# EAGLE design TaschenrechnerPCB (EAGLE 9.6.2)
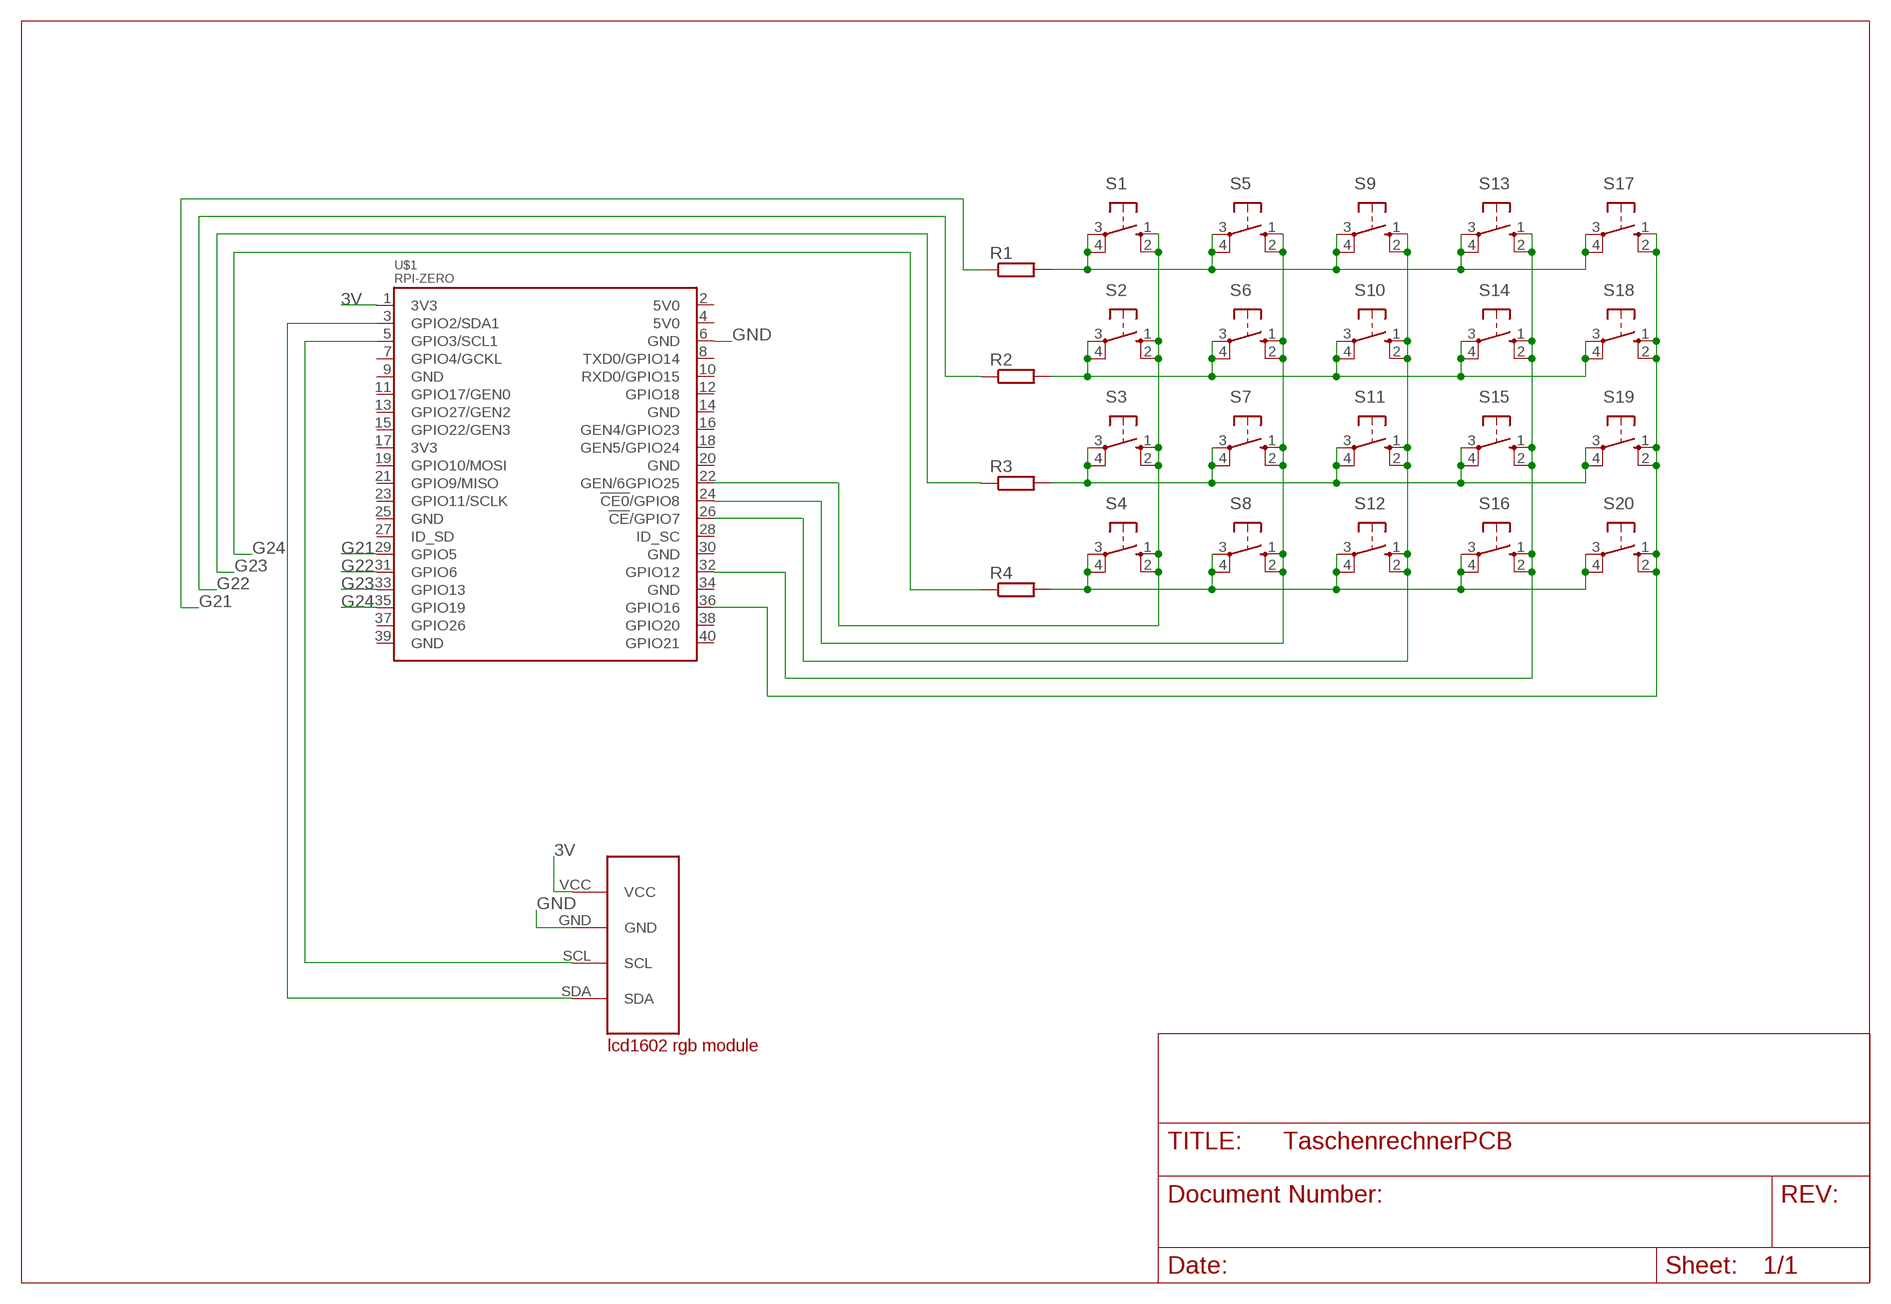
[diagram p0: schematic, sheet 1]

## Parts
R1  R-EU_0207/10  [0207/10]
R2  R-EU_0207/10  [0207/10]
R3  R-EU_0207/10  [0207/10]
R4  R-EU_0207/10  [0207/10]
S1  10-XX  [B3F-10XX]
S2  10-XX  [B3F-10XX]
S3  10-XX  [B3F-10XX]
S4  10-XX  [B3F-10XX]
S5  10-XX  [B3F-10XX]
S6  10-XX  [B3F-10XX]
S7  10-XX  [B3F-10XX]
S8  10-XX  [B3F-10XX]
S9  10-XX  [B3F-10XX]
S10  10-XX  [B3F-10XX]
S11  10-XX  [B3F-10XX]
S12  10-XX  [B3F-10XX]
S13  10-XX  [B3F-10XX]
S14  10-XX  [B3F-10XX]
S15  10-XX  [B3F-10XX]
S16  10-XX  [B3F-10XX]
S17  10-XX  [B3F-10XX]
S18  10-XX  [B3F-10XX]
S19  10-XX  [B3F-10XX]
S20  10-XX  [B3F-10XX]
U$1  RPI-ZERO  [RASP_PI_ZERO_BOARD_FULL]
U$2  LCD1602-RGB-MODULE  [LCD1602-RGB-MODULE]

## Nets
3V: U$1.1(3V3) U$2.VCC
G6: S1.1(S) S1.2(S1) S2.1(S) S2.2(S1) S3.1(S) S3.2(S1) S4.1(S) S4.2(S1) U$1.22(GEN/6GPIO25)
G10: S5.1(S) S5.2(S1) S6.1(S) S6.2(S1) S7.1(S) S7.2(S1) S8.1(S) S8.2(S1) U$1.24(!CE0!/GPIO8)
G11: S9.1(S) S9.2(S1) S10.1(S) S10.2(S1) S11.1(S) S11.2(S1) S12.1(S) S12.2(S1) U$1.26(!CE!/GPIO7)
G21: R1.1 U$1.29(GPIO5)
G22: R2.1 U$1.31(GPIO6)
G23: R3.1 U$1.33(GPIO13)
G24: R4.1 U$1.35(GPIO19)
G26: S13.1(S) S13.2(S1) S14.1(S) S14.2(S1) S15.1(S) S15.2(S1) S16.1(S) S16.2(S1) U$1.32(GPIO12)
G27: S17.1(S) S17.2(S1) S18.1(S) S18.2(S1) S19.1(S) S19.2(S1) S20.1(S) S20.2(S1) U$1.36(GPIO16)
GND: U$1.6(GND) U$2.GND
N$1: U$1.3(GPIO2/SDA1) U$2.SDA
N$2: U$1.5(GPIO3/SCL1) U$2.SCL
N$5: R1.2 S1.3(P) S1.4(P1) S5.3(P) S5.4(P1) S9.3(P) S9.4(P1) S13.3(P) S13.4(P1) S17.3(P) S17.4(P1)
N$12: R2.2 S2.3(P) S2.4(P1) S6.3(P) S6.4(P1) S10.3(P) S10.4(P1) S14.3(P) S14.4(P1) S18.3(P) S18.4(P1)
N$13: R3.2 S3.3(P) S3.4(P1) S7.3(P) S7.4(P1) S11.3(P) S11.4(P1) S15.3(P) S15.4(P1) S19.3(P) S19.4(P1)
N$20: R4.2 S4.3(P) S4.4(P1) S8.3(P) S8.4(P1) S12.3(P) S12.4(P1) S16.3(P) S16.4(P1) S20.3(P) S20.4(P1)
Unconnected: U$1.2(5V0) U$1.4(5V0) U$1.7(GPIO4/GCKL) U$1.8(TXD0/GPIO14) U$1.9(GND) U$1.10(RXD0/GPIO15) U$1.11(GPIO17/GEN0) U$1.12(GPIO18) U$1.13(GPIO27/GEN2) U$1.14(GND) U$1.15(GPIO22/GEN3) U$1.16(GEN4/GPIO23) U$1.17(3V3) U$1.18(GEN5/GPIO24) U$1.19(GPIO10/MOSI) U$1.20(GND) U$1.21(GPIO9/MISO) U$1.23(GPIO11/SCLK) U$1.25(GND) U$1.27(ID_SD) U$1.28(ID_SC) U$1.30(GND) U$1.34(GND) U$1.37(GPIO26) U$1.38(GPIO20) U$1.39(GND) U$1.40(GPIO21)

## Library data of the parts
R1-R4 = rcl:R-EU_: RESISTOR, European symbol; SPICEPREFIX: R
S1-S20 = switch-omron:10-XX: OMRON SWITCH; MPN: B3F-1000; OC_FARNELL: 176432; OC_NEWARK: 36M3542
U$1 = rpi-zero_2:RPI-ZERO
U$2 = lcd1602-rgb-module:LCD1602-RGB-MODULE: LCD1602 RGB Display Connectable via I2C Adapter

## Board
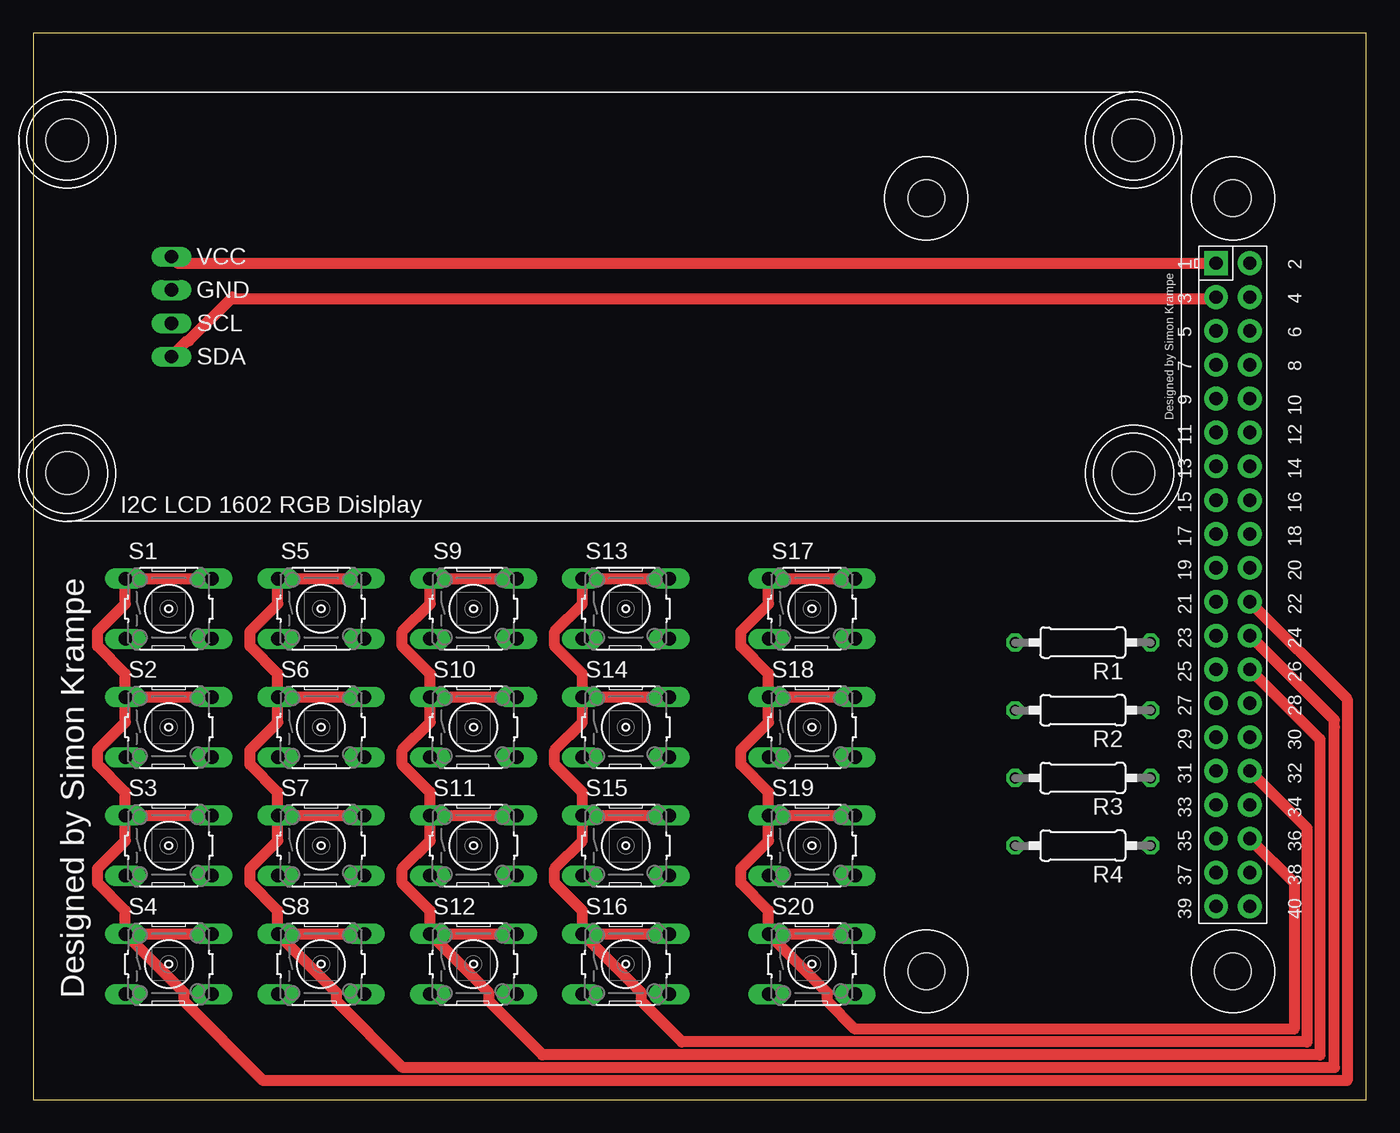
[diagram p1: board, top side]
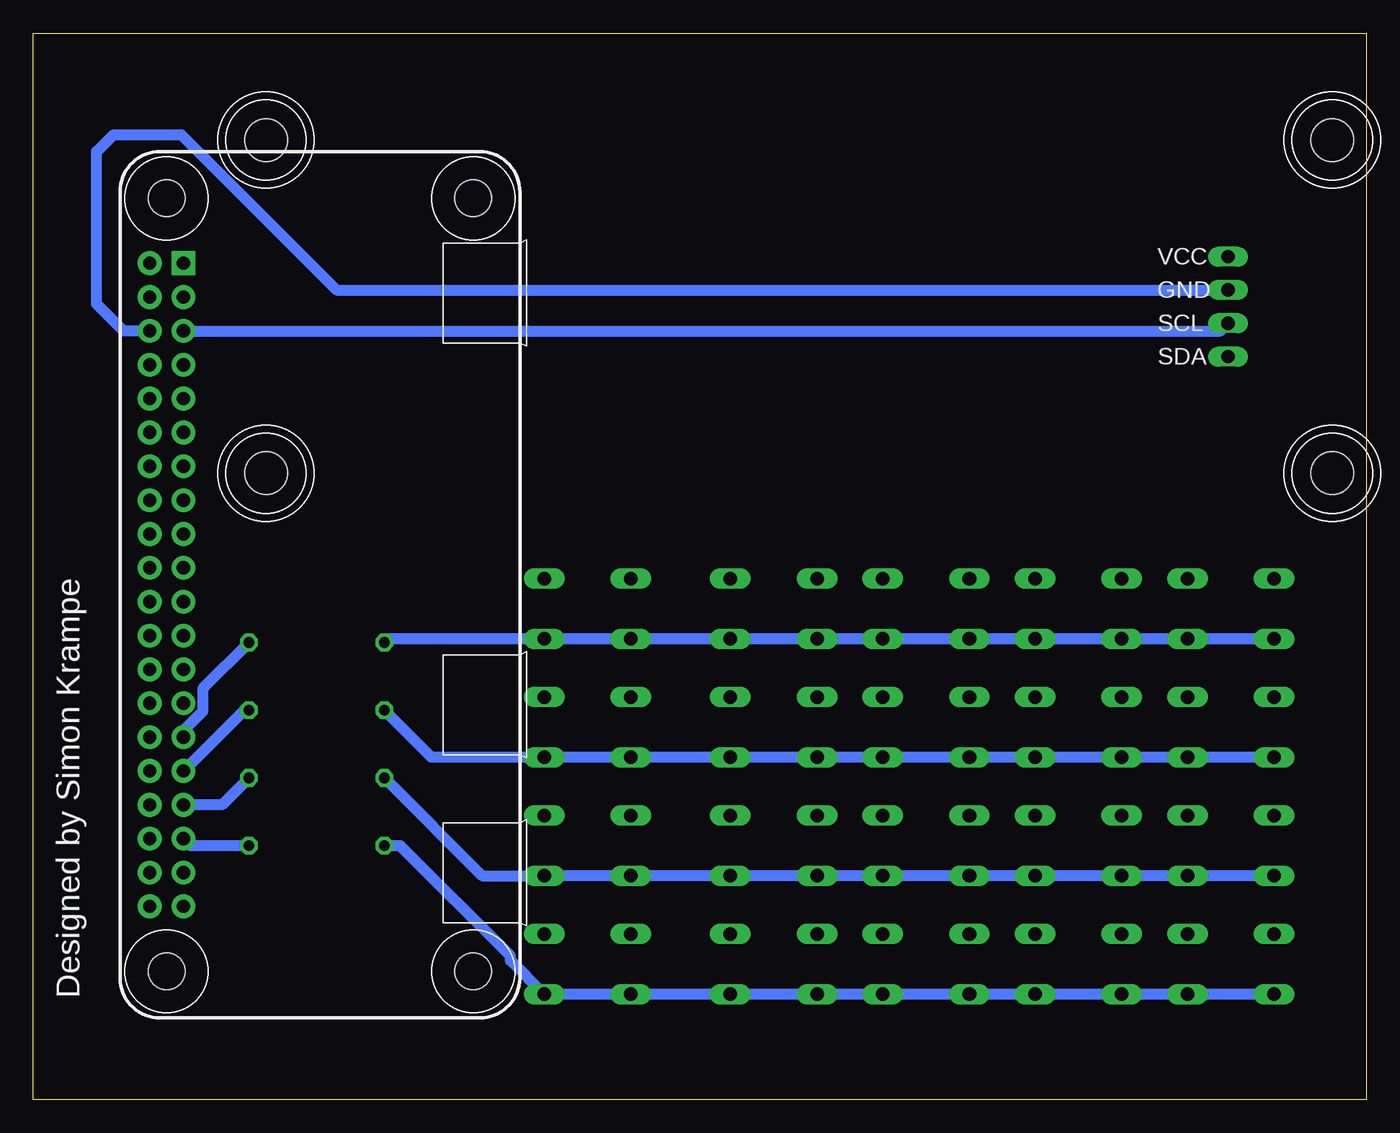
[diagram p2: board, bottom side, seen from below]

Size 100 x 80 mm. Coordinates in mm from the lower left corner, seen from the top.
Outline: 0,0 100,0 100,80 0,80 0,0
Copper layers (1*16): Top 0.035mm / dielectric 1.5mm / Bottom 0.035mm
Design rules "default": minimum track width 6mil, minimum drill 0.35mm, track to track 6mil, track to pad 6mil, pad to pad 6mil, via to via 6mil, smd to smd 6mil, copper to edge 40mil, drill to drill 6mil, minimum pad ring 10mil, minimum via ring 8mil, stop-mask expansion 4mil, vias tented up to drill 0mil, thermal gap 10mil

### Footprints (pad centres in the part's own frame; a part is rotated, then mirrored left to right if it is on the bottom)
0207/10 = drill 0.813 octagon: 1 -5.08,0; 2 5.08,0
B3F-10XX = drill 1.016 long: 1 -3.251,2.261; 2 3.251,2.261; 3 -3.251,-2.261; 4 3.251,-2.261
RASP_PI_ZERO_BOARD_FULL = drill 1 pad 1.778 square: 1 8.37,25.23 | drill 1 pad 1.778: 2 8.37,27.77; 3 10.91,25.23; 4 10.91,27.77; 5 13.45,25.23; 6 13.45,27.77; 7 15.99,25.23; 8 15.99,27.77; 9 18.53,25.23; 10 18.53,27.77; 11 21.07,25.23; 12 21.07,27.77; 13 23.61,25.23; 14 23.61,27.77; 15 26.15,25.23; 16 26.15,27.77; 17 28.69,25.23; 18 28.69,27.77; 19 31.23,25.23; 20 31.23,27.77; 21 33.77,25.23; 22 33.77,27.77; 23 36.31,25.23; 24 36.31,27.77; 25 38.85,25.23; 26 38.85,27.77; 27 41.39,25.23; 28 41.39,27.77; 29 43.93,25.23; 30 43.93,27.77; 31 46.47,25.23; 32 46.47,27.77; 33 49.01,25.23; 34 49.01,27.77; 35 51.55,25.23; 36 51.55,27.77; 37 54.09,25.23; 38 54.09,27.77; 39 56.63,25.23; 40 56.63,27.77 | hole 2.75: 3.5,3.5; 3.5,26.5; 61.5,3.5; 61.5,26.5
LCD1602-RGB-MODULE = drill 1 long: GND 7.82,13.75; SCL 7.82,11.25; SDA 7.82,8.75; VCC 7.82,16.25 | hole 3.2: 0,0; 0,25; 80,0; 80,25

### Placement (x,y rotation side)
R1  78.74,34.29 180 top
R2  78.74,29.21 180 top
R3  78.74,24.13 180 top
R4  78.74,19.05 180 top
S1  10.16,36.83 0 top
S2  10.16,27.94 0 top
S3  10.16,19.05 0 top
S4  10.16,10.16 0 top
S5  21.59,36.83 0 top
S6  21.59,27.94 0 top
S7  21.59,19.05 0 top
S8  21.59,10.16 0 top
S9  33.02,36.83 0 top
S10  33.02,27.94 0 top
S11  33.02,19.05 0 top
S12  33.02,10.16 0 top
S13  44.45,36.83 0 top
S14  44.45,27.94 0 top
S15  44.45,19.05 0 top
S16  44.45,10.16 0 top
S17  58.42,36.83 0 top
S18  58.42,27.94 0 top
S19  58.42,19.05 0 top
S20  58.42,10.16 0 top
U$1  63.5,71.12 270 top
U$2  2.54,46.99 0 top

### Tracks (layer width: path | path; a pad name or v marks a point on that pad's centre or on a via)
3V
  Top 0.813: U$2.VCC 10.85,62.75 U$1.1
G6
  Top 0.813: S4.1 11.33,8 11.33,7.35 17.26,1.42 98.58,1.42 98.58,30.04 U$1.22 | S4.1 S4.2 | S1.2 S1.1 6.91,37.2 4.83,35.12 4.83,34.02 6.91,31.94 S2.1 | S2.1 S2.2 | S3.1 S3.2 | S4.1 6.91,14.16 4.83,16.24 4.83,17.34 6.91,19.42 S3.1 | S3.1 6.91,23.05 4.83,25.13 4.83,26.23 6.91,28.31 S2.1
G10
  Top 0.813: S8.1 22.76,8 22.76,7.35 27.72,2.39 97.61,2.39 97.61,27.94 97.61,28.47 U$1.24 | S8.1 S8.2 | S5.2 S5.1 18.34,37.2 16.26,35.12 16.26,34.02 18.34,31.94 S6.1 | S8.1 18.34,14.16 16.26,16.24 16.26,17.34 18.34,19.42 S7.1 | S7.1 18.34,23.05 16.26,25.13 16.26,26.23 18.34,28.31 S6.1 | S6.1 S6.2 | S7.1 S7.2
G11
  Top 0.813: S12.1 34.19,8 34.19,7.35 38.19,3.35 96.52,3.35 96.52,27.02 U$1.26 | S12.1 S12.2 | S11.1 S11.2 | S10.1 S10.2 | S9.2 S9.1 29.77,37.2 27.69,35.12 27.69,34.02 29.77,31.94 S10.1 | S12.1 29.77,14.16 27.69,16.24 27.69,17.34 29.77,19.42 S11.1 | S11.1 29.77,23.05 27.69,25.13 27.69,26.23 29.77,28.31 S10.1
G21
  Bottom 0.813: R1.1 87.28,30.83 87.28,29.13 88.73,27.68 U$1.29
G22
  Bottom 0.813: R2.1 84.17,29.21 U$1.31
G23
  Bottom 0.813: R3.1 85.84,22.11 U$1.33
G24
  Bottom 0.813: R4.1 88.21,19.05 U$1.35
G26
  Top 0.813: S16.1 45.62,8 45.62,7.35 48.65,4.32 95.56,4.32 95.56,20.36 U$1.32 | S16.1 S16.2 | S13.2 S13.1 41.2,37.2 39.12,35.12 39.12,34.02 41.2,31.94 S14.1 | S14.1 S14.2 | S15.1 S15.2 | S16.1 41.2,14.16 39.12,16.24 39.12,17.34 41.2,19.42 S15.1 | S15.1 41.2,23.05 39.12,25.13 39.12,26.23 41.2,28.31 S14.1
G27
  Top 0.813: S20.1 59.59,8 59.59,7.35 61.66,5.28 94.59,5.28 94.59,16.25 U$1.36 | S20.1 S20.2 | S19.1 S19.2 | S18.1 S18.2 | S17.2 S17.1 55.17,37.2 53.09,35.12 53.09,34.02 55.17,31.94 S18.1 | S20.1 55.17,14.16 53.09,16.24 53.09,17.34 55.17,19.42 S19.1 | S19.1 55.17,23.05 53.09,25.13 53.09,26.23 55.17,28.31 S18.1
GND
  Bottom 0.813: U$2.GND 77.25,60.74 88.9,72.39 93.98,72.39 95.25,71.12 95.25,59.69 93.23,57.67 U$1.6
N$1
  Top 0.813: U$2.SDA 11.55,56.93 11.66,56.93 14.83,60.1 | 14.94,60.21 14.83,60.1 | 14.83,60.1 88.62,60.1 U$1.3
N$2
  Bottom 0.813: U$1.5 10.93,57.67 U$2.SCL
N$5
  Bottom 0.813: R1.2 73.38,34.57 S17.4 S17.3 S13.4 S13.3 S9.4 S9.3 S5.4 S5.3 S1.4 S1.3
N$12
  Bottom 0.813: R2.2 70.13,25.68 S18.4 S18.3 S14.4 S14.3 S10.4 S10.3 S6.4 S6.3 S2.4 S2.3
N$13
  Bottom 0.813: R3.2 66.32,16.79 S19.4 S19.3 S15.4 S15.3 S11.4 S11.3 S7.4 S7.3 S3.4 S3.3
N$20
  Bottom 0.813: S4.3 S4.4 S8.3 S8.4 S12.3 S12.4 S16.3 S16.4 S20.3 S20.4 64.2,10.43 64.2,10.78 72.47,19.05 R4.2

### Text on the board
tPlace: Designed by Simon Krampe
bPlace: Designed by Simon Krampe